# Altium schematic sheet [05] - PERIPHERALS.SchDoc
size A4
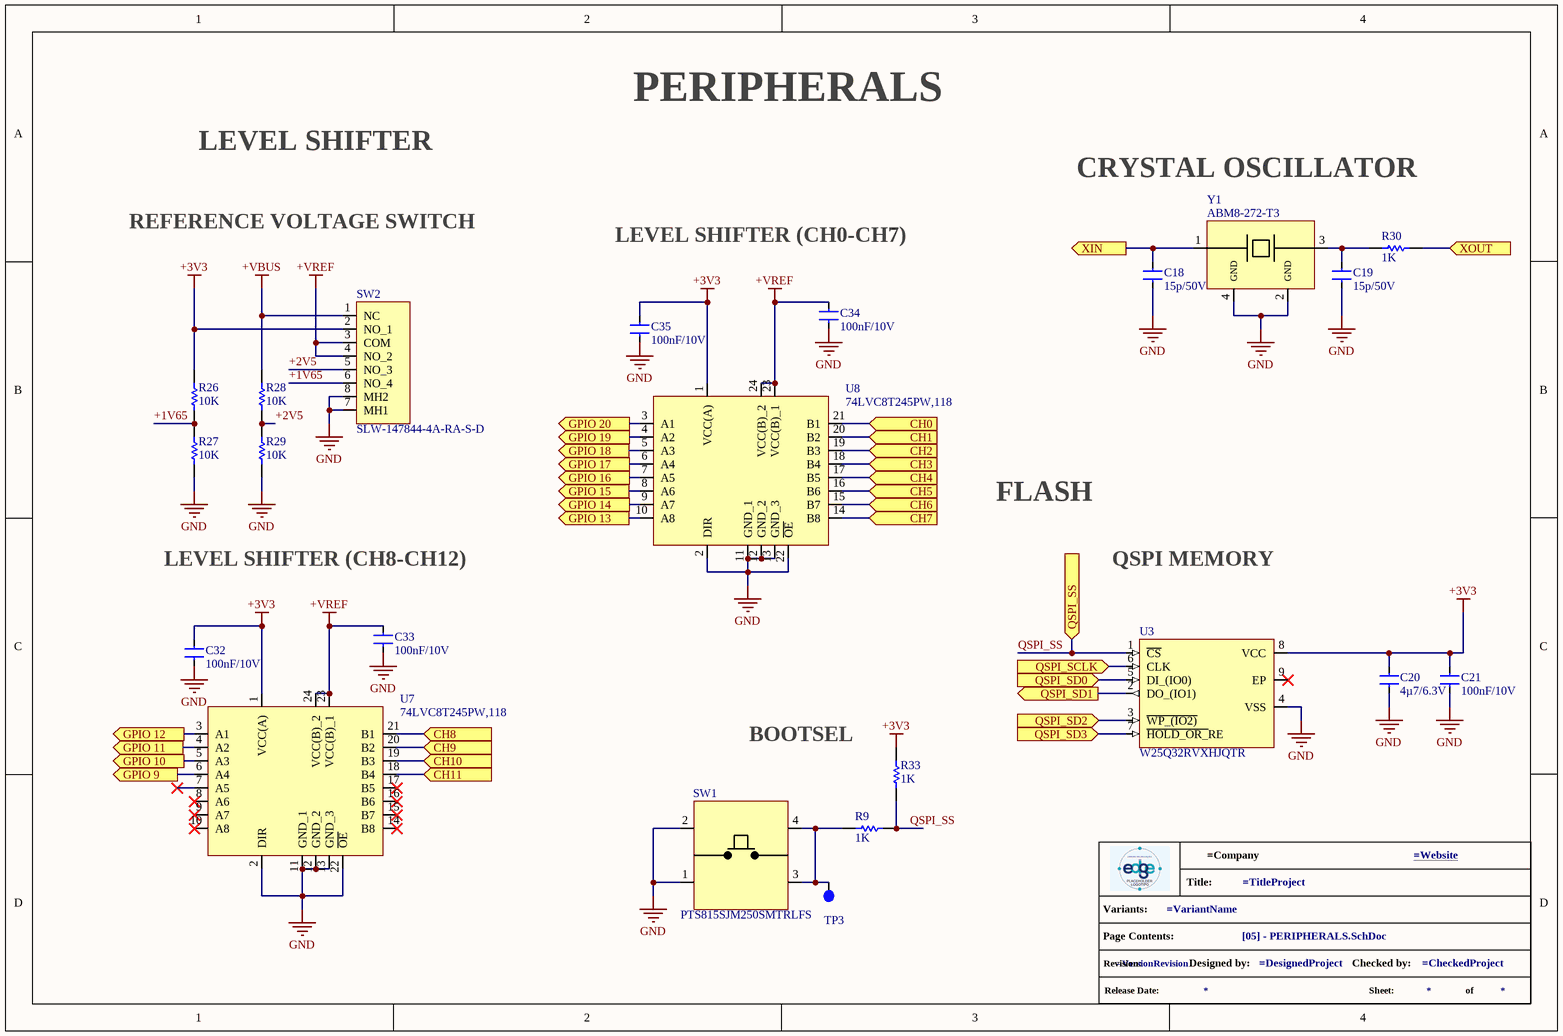
[diagram p0: [05] - PERIPHERALS.SchDoc]

## Parts
*?  info_project  (value not drawn)  (graphical)
C18  15p/50V  [C0402]
C19  15p/50V  [C0402]
C20  4µ7/6.3V  [C0402]
C21  100nF/10V  [C0402]
C32  100nF/10V  [C0402]
C33  100nF/10V  [C0402]
C34  100nF/10V  [C0402]
C35  100nF/10V  [C0402]
R9  1K  [R0603]
R26  10K  [R0402]
R27  10K  [R0402]
R28  10K  [R0402]
R29  10K  [R0402]
R30  1K  [R0603]
R33  1K  [R0603]
SW1  PTS815SJM250SMTRLFS  [PTS526SK15SMTR2_LFS]
SW2  SLW-147844-4A-RA-S-D  [SLW-147844-4A-RA-S-D]
TP3  TestPoint  [Test Point]  (value not drawn)  (no BOM)
U3  W25Q32RVXHJQTR  [W25Q32RVXHJQ_TR]
U7  74LVC8T245PW,118  [74LVC8T245PW,118]
U8  74LVC8T245PW,118  [74LVC8T245PW,118]
Y1  ABM8-272-T3  [ABM8-272-T3]

## Ports
CH0 (in), CH1 (in), CH2 (in), CH3 (in), CH4 (in), CH5 (in), CH6 (in), CH7 (in), CH8 (in), CH9 (in), CH10 (in), CH11 (in), GPIO 9 (out), GPIO 10 (out), GPIO 11 (out), GPIO 12 (out), GPIO 13 (out), GPIO 14 (out), GPIO 15 (out), GPIO 16 (out), GPIO 17 (out), GPIO 18 (out), GPIO 19 (out), GPIO 20 (out), QSPI_SCLK (in), QSPI_SD0 (in), QSPI_SD1 (out), QSPI_SD2 (in), QSPI_SD3 (in), QSPI_SS (in), XIN (out), XOUT (in)

## Nets
+3V3: C20.2 C21.2 C32.2 C35.2 R26.1 R33.2 SW2.2(NO_1) U3.8(VCC) U7.1(VCC(A)) U8.1(VCC(A))
+VBUS: R28.1 SW2.1(NC)
+VREF: C33.2 C34.2 SW2.3(COM) SW2.4(NO_2) U7.23(VCC(B)_1) U7.24(VCC(B)_2) U8.23(VCC(B)_1) U8.24(VCC(B)_2)
GND: C18.1 C19.1 C20.1 C21.1 C32.1 C33.1 C34.1 C35.1 R27.1 R29.2 SW1.1(COM_1) SW1.2(COM_2) SW2.7(MH1) SW2.8(MH2) U3.4(VSS) U7.2(DIR) U7.11(GND_1) U7.12(GND_2) U7.13(GND_3) U7.22(~{OE}) U8.2(DIR) U8.11(GND_1) U8.12(GND_2) U8.13(GND_3) U8.22(~{OE}) Y1.2(GND) Y1.4(GND)
+1V65: R26.2 R27.2 SW2.6(NO_4)
+2V5: R28.2 R29.1 SW2.5(NO_3)
CH0: U8.21(B1) ; port CH0
CH1: U8.20(B2) ; port CH1
CH2: U8.19(B3) ; port CH2
CH3: U8.18(B4) ; port CH3
CH4: U8.17(B5) ; port CH4
CH5: U8.16(B6) ; port CH5
CH6: U8.15(B7) ; port CH6
CH7: U8.14(B8) ; port CH7
CH8: U7.21(B1) ; port CH8
CH9: U7.20(B2) ; port CH9
CH10: U7.19(B3) ; port CH10
CH11: U7.18(B4) ; port CH11
GPIO 9: U7.6(A4) ; port GPIO 9
GPIO 10: U7.5(A3) ; port GPIO 10
GPIO 11: U7.4(A2) ; port GPIO 11
GPIO 12: U7.3(A1) ; port GPIO 12
GPIO 13: U8.10(A8) ; port GPIO 13
GPIO 14: U8.9(A7) ; port GPIO 14
GPIO 15: U8.8(A6) ; port GPIO 15
GPIO 16: U8.7(A5) ; port GPIO 16
GPIO 17: U8.6(A4) ; port GPIO 17
GPIO 18: U8.5(A3) ; port GPIO 18
GPIO 19: U8.4(A2) ; port GPIO 19
GPIO 20: U8.3(A1) ; port GPIO 20
QSPI_SCLK: U3.6(CLK) ; port QSPI_SCLK
QSPI_SD0: U3.5(DI_(IO0)) ; port QSPI_SD0
QSPI_SD1: U3.2(DO_(IO1)) ; port QSPI_SD1
QSPI_SD2: U3.3(~{WP_(IO2)}) ; port QSPI_SD2
QSPI_SD3: U3.7(~{HOLD_OR_}RE) ; port QSPI_SD3
QSPI_SS: R9.2 R33.1 U3.1(~{CS}) ; port QSPI_SS
XIN: C18.2 Y1.1(C1) ; port XIN
XOUT: R30.2 ; port XOUT
NetC19_2: C19.2 R30.1 Y1.3(C2)
NetR9_1: R9.1 SW1.3(NO_1) SW1.4(NO_2) TP3.1

Not connected (* = marked no-connect by the designer): U3 9(EP)*; U7 7(A5)* 8(A6)* 9(A7)* 10(A8)* 14(B8)* 15(B7)* 16(B6)* 17(B5)*

## Notes on the sheet
- PERIPHERALS
- LEVEL SHIFTER
- CRYSTAL OSCILLATOR
- REFERENCE VOLTAGE SWITCH
- LEVEL SHIFTER (CH0-CH7)
- FLASH
- LEVEL SHIFTER (CH8-CH12)
- QSPI MEMORY
- BOOTSEL
- (in symbol info_project) Title:; Variants:; Page Contents:; Revision:; Designed by:; Checked by:; Release Date:; Sheet:; of

## Library data of the parts
C18 C19 = GJM1555C1H150FB01D: MLCC - 15 pF 50V 0402 X5R ±1%  Ceramic Capacitor C0G, NP0; Manufacturer 1: Murata; Value: 15pF; Multilayer: Yes; .Mounting: SMT; Supplier: Digikey; Supplier Part Number: 490-11191-1-ND; Manufacturer Part Number 1: GJM1555C1H150FB01D; RoHS: Yes; Category: Ceramic Capacitors; Stock: 61415; Pricing: 1=0,13, 10=0,074, 100=0,0446, 1000=0,02973, 2500=0,02606, 5000=0,02385 (USD); Mounting Technology: Surface Mount; Pins: 2; Dielectric Material: Ceramic; Package Shape: Rectangular; Case/Package: 0402; Terminal Finish: Nickel; Min Operating Temperature: -55°C; Max Operating Temperature: 125°C; JESD-609 Code: e3; Capacitor Type: Ceramic; Tolerance  (fill in as +-): 1%; Packaging: Tape and Reel; Tolerance (fill in as +-): 1%; Rated DC Voltage (URdc): 50V; Temperature Characteristics Code: C0G; Termination: Wraparound; Reach SVHC Compliant: Yes; RoHS Compliant: Yes; ComponentLink1URL: https://datasheet.ciiva.com:443/pdfs/VipMasterIC/IC/MURE/MURE-S-A0004383799/MURE-S-A0004384018-1.pdf?src-supplier=IHS+Markit; ComponentLink1Description: https://datasheet.ciiva.com:443/pdfs/VipMasterIC/IC/MURE/MURE-S-A0004383799/MURE-S-A0004384018-1.pdf?src-supplier=IHS+Markit; ComponentLink2URL: https://datasheet.ciiva.com/11608/c02e-11608383.pdf?src-supplier=Avnet; ComponentLink2Description: https://datasheet.ciiva.com/11608/c02e-11608383.pdf?src-supplier=Avnet; .PCBChecked: *; .SCHChecked: *
C20 = CL05A475KQ5NRNC: MLCC - 4.7 µF 6.3V 0402 X5R ±10%  Ceramic Capacitor X5R; Manufacturer 1: Samsung; Value: 4.7uF; Multilayer: Yes; .Mounting: SMT; Supplier: Digikey; Supplier Part Number: 1276-1481-1-ND; RoHS: Yes; Category: Ceramic Capacitors; Stock: 761086; Pricing: 1=0,08, 10=0,026, 100=0,016, 1000=0,0112, 2500=0,0096 (USD); Mounting Technology: Surface Mount; Pins: 2; Dielectric Material: Ceramic; Package Shape: Rectangular; Case/Package: 0402; Terminal Finish: Nickel; Min Operating Temperature: -55°C; Max Operating Temperature: 85°C; JESD-609 Code: e3; Capacitor Type: Ceramic; Tolerance  (fill in as +-): 10%; Packaging: Tape and Reel; Tolerance (fill in as +-): 10%; Rated DC Voltage (URdc): 6.3V; Temperature Characteristics Code: X5R; Termination: Wraparound; Reach SVHC Compliant: Yes; RoHS Compliant: Yes; ComponentLink1URL: https://datasheet.ciiva.com:443/pdfs/VipMasterIC/IC/SEMS/SEMS-S-A0008521219/SEMS-S-A0008521124-1.pdf?src-supplier=IHS+Markit; ComponentLink1Description: https://datasheet.ciiva.com:443/pdfs/VipMasterIC/IC/SEMS/SEMS-S-A0008521219/SEMS-S-A0008521124-1.pdf?src-supplier=IHS+Markit; ComponentLink2URL: https://datasheet.ciiva.com/25793/cl05a475kq5nrnc-25793634.pdf?src-supplier=Digikey; ComponentLink2Description: https://datasheet.ciiva.com/25793/cl05a475kq5nrnc-25793634.pdf?src-supplier=Digikey; ComponentLink3URL: https://datasheet.ciiva.com/26838/getdatasheetpartid-353228-26838196.pdf?src-supplier=Verical; ComponentLink3Description: https://datasheet.ciiva.com/26838/getdatasheetpartid-353228-26838196.pdf?src-supplier=Verical; .PCBChecked: *; .SCHChecked: *; Manufacturer Part Number 1: CL05A475KQ5NRNC
C21 C32-C35 = CL05B104KP5NNNC: MLCC - 100nF 10V X7R 0402 ±10% Ceramic Capacitor; Manufacturer 1: Samsung; Multilayer: Yes; .Mounting: SMT; Supplier: Digikey; Supplier Part Number: 1276-1002-1-ND; RoHS: Yes; Category: Ceramic Capacitors; Stock: 29591550; Pricing: 1=0,08, 10=0,004, 100=0,0036, 1000=0,0032 (USD); Mounting Technology: Surface Mount; Pins: 2; Dielectric Material: Ceramic; Package Shape: Rectangular; Case/Package: 0402; Terminal Finish: Nickel; Min Operating Temperature: -55°C; Max Operating Temperature: 125°C; JESD-609 Code: e3; Value: 100nF; Capacitor Type: Ceramic; Tolerance  (fill in as +-): 10%; Package Style: SMTMeter; Packaging: Tape and Reel; Tolerance (fill in as +-): 10%; Rated DC Voltage (URdc): 10V; Temperature Characteristics Code: X7R; Termination: Wraparound; Length: 1mm; Width: 0.5mm; Height: 0.5mm; Reach SVHC Compliant: Yes; RoHS Compliant: Yes; ComponentLink1URL: https://datasheet.ciiva.com:443/pdfs/VipMasterIC/IC/SEMS/SEMS-S-A0008523115/SEMS-S-A0008523129-1.pdf?src-supplier=IHS+Markit; ComponentLink1Description: https://datasheet.ciiva.com:443/pdfs/VipMasterIC/IC/SEMS/SEMS-S-A0008523115/SEMS-S-A0008523129-1.pdf?src-supplier=IHS+Markit; ComponentLink2URL: https://datasheet.ciiva.com/15165/getdatasheetpartid-37100-15165107.pdf?src-supplier=Verical; ComponentLink2Description: https://datasheet.ciiva.com/15165/getdatasheetpartid-37100-15165107.pdf?src-supplier=Verical; ComponentLink3URL: https://datasheet.ciiva.com/16498/cl05b104kq5nnnc-16498491.pdf?src-supplier=Future+Electronics; ComponentLink3Description: https://datasheet.ciiva.com/16498/cl05b104kq5nnnc-16498491.pdf?src-supplier=Future+Electronics; .PCBChecked: *; .SCHChecked: *; Manufacturer Part Number 1: CL05B104KP5NNNC
R9 R30 R33 = RMCF0603FT1K00: RES - 1K 1/10W 0603  ±1%; Manufacturer 1: Stackpole Electronics; Power: 100mW; Rated Temperature: 70°C; Value: 1kR; Working Voltage: 75V; Temperature Coefficient (ppm/Cel): 100; Package Height: 0.45mm; Package Length: 1.55mm; Package Width: 0.8mm; Reference Standard: AEC-Q200; .Mounting: SMT; Supplier: Digikey; Supplier Part Number: RMCF0603FT1K00CT-ND; RoHS: Yes; Category: Chip SMD Resistors; Stock: 2369156; Pricing: 1=0,1, 10=0,02, 100=0,0091, 1000=0,0048, 2500=0,00386 (USD); Mounting Technology: Surface Mount; Pins: 2; Package Shape: Rectangular; Case/Package: 0603; Terminal Finish: Nickel; Min Operating Temperature: -55°C; Max Operating Temperature: 155°C; Tolerance: 1%; JESD-609 Code: e3; Resistor Type: FIXED RESISTOR; Construction: Rectangular; Packaging: Tape and Reel; Technology: METAL GLAZE/THICK FILM; Termination: Wraparound; Reach SVHC Compliant: Yes; RoHS Compliant: Yes; ComponentLink1URL: https://datasheet.ciiva.com:443/pdfs/VipMasterIC/IC/SEIE/SEIE-S-A0009541969/SEIE-S-A0009541969-1.pdf?src-supplier=IHS+Markit; ComponentLink1Description: https://datasheet.ciiva.com:443/pdfs/VipMasterIC/IC/SEIE/SEIE-S-A0009541969/SEIE-S-A0009541969-1.pdf?src-supplier=IHS+Markit; ComponentLink2URL: https://www.seielect.com/catalog/SEI-Packaging.pdf?src-supplier=Avnet; ComponentLink2Description: https://www.seielect.com/catalog/SEI-Packaging.pdf?src-supplier=Avnet; ComponentLink3URL: https://www.seielect.com/catalog/SEI-RMCF_RMCP.pdf?src-supplier=Avnet; ComponentLink3Description: https://www.seielect.com/catalog/SEI-RMCF_RMCP.pdf?src-supplier=Avnet; ComponentLink4URL: https://www.seielect.com/catalog/sei-rmcf_rmcp.pdf?src-supplier=Digikey; ComponentLink4Description: https://www.seielect.com/catalog/sei-rmcf_rmcp.pdf?src-supplier=Digikey; ComponentLink5URL: http://www.seielect.com/Catalog/SEI-rmc.pdf?src-supplier=Future+Electronics; ComponentLink5Description: http://www.seielect.com/Catalog/SEI-rmc.pdf?src-supplier=Future+Electronics; ComponentLink6URL: https://datasheet.octopart.com/RMCF0603FT1K00-Stackpole-Electronics-datasheet-11547379.pdf?src-supplier=Future+Electronics; ComponentLink6Description: https://datasheet.octopart.com/RMCF0603FT1K00-Stackpole-Electronics-datasheet-11547379.pdf?src-supplier=Future+Electronics; ComponentLink7URL: https://www.seielect.com/catalog/SEI-Packaging.pdf?src-supplier=Arrow+Electronics; ComponentLink7Description: https://www.seielect.com/catalog/SEI-Packaging.pdf?src-supplier=Arrow+Electronics; ComponentLink8URL: https://www.seielect.com/catalog/SEI-Packaging.pdf?src-supplier=Verical; ComponentLink8Description: https://www.seielect.com/catalog/SEI-Packaging.pdf?src-supplier=Verical; ComponentLink9URL: https://www.seielect.com/catalog/SEI-Packaging.pdf?src-supplier=Quest; ComponentLink9Description: https://www.seielect.com/catalog/SEI-Packaging.pdf?src-supplier=Quest; ComponentLink10URL: https://datasheet.octopart.com/RMCF0603FT1K00-Stackpole-Electronics-datasheet-155966809.pdf?src-supplier=Electro+Sonic; ComponentLink10Description: https://datasheet.octopart.com/RMCF0603FT1K00-Stackpole-Electronics-datasheet-155966809.pdf?src-supplier=Electro+Sonic; ComponentLink11URL: https://datasheet.octopart.com/RMCF0603FT1K00-Stackpole-Electronics-datasheet-155966809.pdf?src-supplier=Master+Electronics; ComponentLink11Description: https://datasheet.octopart.com/RMCF0603FT1K00-Stackpole-Electronics-datasheet-155966809.pdf?src-supplier=Master+Electronics; .PCBChecked: *; .SCHChecked: *; Manufacturer Part Number 1: RMCF0603FT1K00
R26-R29 = RC1005F103CS: RES - 10K 1/16W 0402 ±1% Chip Resistor; Manufacturer 1: Samsung; Power: 60mW; Value: 10kR; Working Voltage: 50V; Temperature Coefficient (ppm/Cel): 100; Package Height: 0.35mm; Package Length: 1mm; Package Width: 0.5mm; .Mounting: SMT; Supplier: Digikey; Supplier Part Number: 1276-3431-1-ND; RoHS: Yes; Category: Chip SMD Resistors; Stock: 10935408; Pricing: 1=0,1, 10=0,039, 100=0,0201, 1000=0,01175, 2500=0,0099, 5000=0,00882 (USD); Mounting Technology: Surface Mount; Pins: 2; Package Shape: Rectangular; Case/Package: 0402; Terminal Finish: Nickel; Min Operating Temperature: -55°C; Max Operating Temperature: 125°C; Tolerance: 1%; JESD-609 Code: e3; Resistor Type: FIXED RESISTOR; Construction: Chip; Packaging: Tape and Reel; Technology: METAL GLAZE/THICK FILM; Reach SVHC Compliant: Yes; RoHS Compliant: Yes; ComponentLink1URL: https://datasheet.ciiva.com:443/pdfs/VipMasterIC/IC/SEMS/SEMS-S-A0001326806/SEMS-S-A0001326806-1.pdf?src-supplier=IHS+Markit; ComponentLink1Description: https://datasheet.ciiva.com:443/pdfs/VipMasterIC/IC/SEMS/SEMS-S-A0001326806/SEMS-S-A0001326806-1.pdf?src-supplier=IHS+Markit; ComponentLink2URL: https://datasheet.ciiva.com/15196/getdatasheetpartid-504789-15196214.pdf?src-supplier=Verical; ComponentLink2Description: https://datasheet.ciiva.com/15196/getdatasheetpartid-504789-15196214.pdf?src-supplier=Verical; ComponentLink3URL: https://datasheet.ciiva.com/16481/rcseries-16481007.pdf?src-supplier=Future+Electronics; ComponentLink3Description: https://datasheet.ciiva.com/16481/rcseries-16481007.pdf?src-supplier=Future+Electronics; .PCBChecked: *; .SCHChecked: *; Manufacturer Part Number 1: RC1005F103CS
SW1 = PTS815SJM250SMTRLFS: SWITCH - Tactile Switch SPST-NO Top Actuated Surface Mount; Manufacturer 1: ITT C&K; .Mounting: SMT; Supplier: Digikey; Supplier Part Number: CKN12215-1-ND; Manufacturer Part Number 1: PTS815SJM250SMTRLFS; RoHS: Yes; Category: Tactile Switches; Stock: 10550; Pricing: 1=0,22, 10=0,191, 25=0,1788, 100=0,1606, 250=0,14892, 500=0,14052, 1000=0,13263 (USD); ComponentLink1URL: https://datasheet.octopart.com/PTS815-SJM-250-SMTR-LFS-C%26K-Components-datasheet-175421037.pdf?src-supplier=Element14; ComponentLink1Description: https://datasheet.octopart.com/PTS815-SJM-250-SMTR-LFS-C%26K-Components-datasheet-175421037.pdf?src-supplier=Element14; ComponentLink2URL: https://dznh3ojzb2azq.cloudfront.net/products/Tactile/PTS815/documents/datasheet.pdf?src-supplier=Digikey; ComponentLink2Description: https://dznh3ojzb2azq.cloudfront.net/products/Tactile/PTS815/documents/datasheet.pdf?src-supplier=Digikey; ComponentLink3URL: https://datasheet.octopart.com/PTS815-SJM-250-SMTR-LFS-C%26K-Components-datasheet-175421037.pdf?src-supplier=Farnell; ComponentLink3Description: https://datasheet.octopart.com/PTS815-SJM-250-SMTR-LFS-C%26K-Components-datasheet-175421037.pdf?src-supplier=Farnell; ComponentLink4URL: https://datasheet.octopart.com/PTS815SJM250SMTRLFS-C%26K-Components-datasheet-166147782.pdf?src-supplier=TME; ComponentLink4Description: https://datasheet.octopart.com/PTS815SJM250SMTRLFS-C%26K-Components-datasheet-166147782.pdf?src-supplier=TME; .SCHChecked: *; .PCBChecked: *
SW2 = SLW-147844-4A-RA-S-D: SWITCH - Slide Switch SP4T Through Hole, Right Angle; Manufacturer 1: Same Sky; .Mounting: PTH; Datasheet Link: https://www.sameskydevices.com/product/resource/slw-147844-4a-ra-s-d.pdf; Height: 5mm; Mouser Part Number: 179-SLW1478444ARASD; Mouser Price/Stock: https://www.mouser.co.uk/ProductDetail/Same-Sky/SLW-147844-4A-RA-S-D?qs=IKkN%2F947nfAwyC%2FZGCUEUg%3D%3D; Arrow Part Number: SLW-147844-4A-RA-S-D; Arrow Price/Stock: https://www.arrow.com/en/products/slw-147844-4a-ra-s-d/cui-devices?utm_currency=USD&region=nac; Manufacturer Part Number 1: SLW-147844-4A-RA-S-D; .PCBChecked: *; .SCHChecked: *
TP3 = Test_Point: MECH - Test Points
U3 = W25Q32RVXHJQ TR: IC - FLASH - NOR Memory IC 32Mbit SPI - Quad I/O 133 MHz 8-XSON (2x3); Manufacturer 1: Winbond; .Mounting: SMT; Datasheet Link: https://www.winbond.com/hq/product/code-storage-flash-memory/serial-nor-flash/?__locale=ja&partNo=W25Q32RV; Height: 0.4mm; Manufacturer Part Number 1: W25Q32RVXHJQ TR; Mouser Part Number: 454-W25Q32RVXHJQTR; Mouser Price/Stock: https://www.mouser.co.uk/ProductDetail/Winbond/W25Q32RVXHJQ-TR?qs=mELouGlnn3dFwM4lg8JCig%3D%3D; Arrow Part Number: W25Q32RVXHJQ TR; Arrow Price/Stock: https://www.arrow.com/en/products/w25q32rvxhjq-tr/winbond-electronics?utm_currency=USD&region=nac; .PCBCheked: *; .SCHChecked: *
U7 U8 = 74LVC8T245PW,118: IC - Translation Transceiver 1 Element 8 Bit per Element 3-State Output 24-TSSOP; Manufacturer 1: Nexperia; .Mounting: SMT; Datasheet Link: https://assets.nexperia.com/documents/data-sheet/74LVC_LVCH8T245.pdf; Height: 1.1mm; Mouser Part Number: 771-74LVC8T245PW118; Mouser Price/Stock: https://www.mouser.co.uk/ProductDetail/Nexperia/74LVC8T245PW118?qs=jquClx72t9C%2Fd6XxNRL47g%3D%3D; Arrow Part Number: 74LVC8T245PW,118; Arrow Price/Stock: https://www.arrow.com/en/products/74lvc8t245pw118/nexperia?region=nac; .PBChecked: *; .SCHChecked: *; Manufacturer Part Number 1: 74LVC8T245PW,118
Y1 = ABM8-272-T3: IC - CRYSTAL 12 MHz ±30ppm Crystal 10pF 50 Ohms 4-SMD, No Lead; Manufacturer 1: ABRACON; .Mounting: SMT; Datasheet Link: https://abracon.com/datasheets/ABM8-272-T3.pdf; Height: 0.8mm; Mouser Part Number: 815-ABM8-272-T3; Mouser Price/Stock: https://www.mouser.co.uk/ProductDetail/ABRACON/ABM8-272-T3?qs=QpmGXVUTftEj6miOiJBMxQ%3D%3D; .PCBChecked: *; .SCHChecked: *; Manufacturer Part Number 1: ABM8-272-T3